# Altium schematic sheet 3_POWER SWITCH AND LDO.SchDoc
size 420 x 297 mm; SheetNumber: 3; SheetTotal: 7
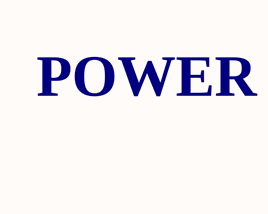
[diagram p0: 3_POWER SWITCH AND LDO.SchDoc, top left]
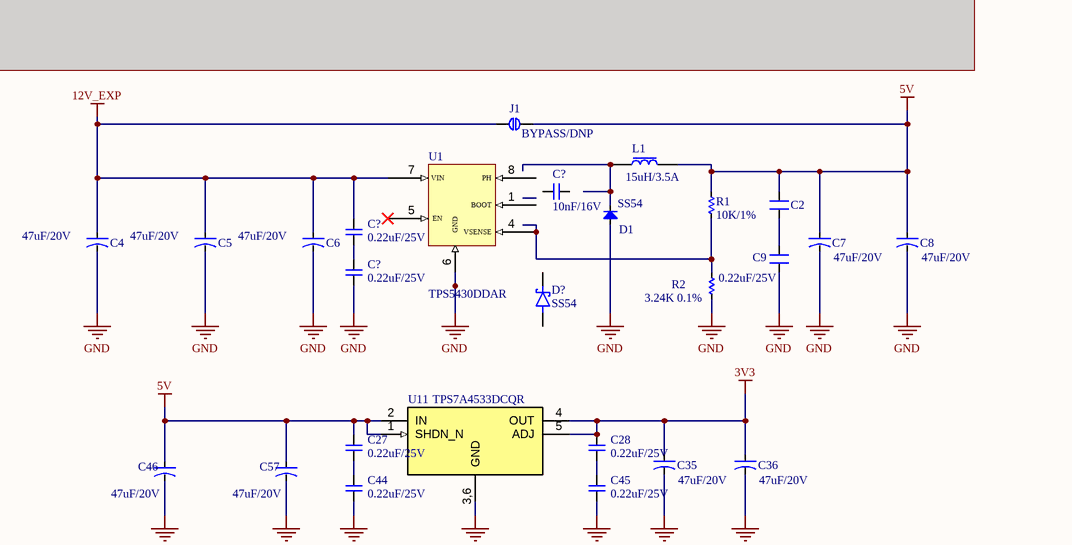
[diagram p1: 3_POWER SWITCH AND LDO.SchDoc, top right]
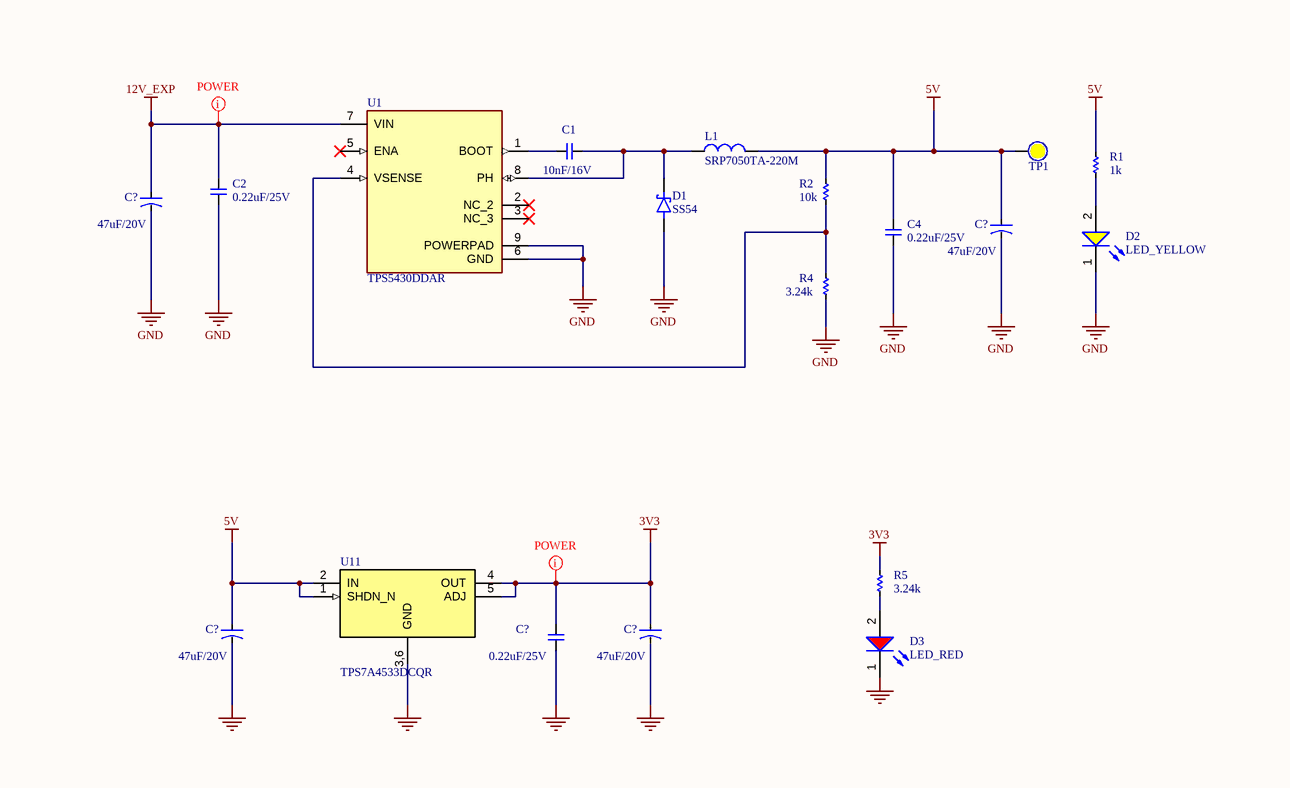
[diagram p2: 3_POWER SWITCH AND LDO.SchDoc, bottom right]

## Parts
(Parts that share a designator on the sheet are numbered #1, #2 ... from top to bottom, then left to right.)
C1  10nF/16V  [CAP_C_1005X50_L]
C2#1  0.22uF/25V  [SM-0603]  (value not drawn)
C2#2  0.22uF/25V  [CAP_C_1608X80]
C4#1  47uF/20V  [CAP TANT 2312]
C4#2  0.22uF/25V  [CAP_C_1608X80]
C5  47uF/20V  [CAP TANT 2312]
C6  47uF/20V  [CAP TANT 2312]
C7  47uF/20V  [CAP TANT 2312]
C8  47uF/20V  [CAP TANT 2312]
C9  0.22uF/25V  [SM-0603]
C27  0.22uF/25V  [CAP_C_1608X80]
C28  0.22uF/25V  [CAP_C_1608X80]
C35  47uF/20V  [CAP TANT 2312]
C36  47uF/20V  [CAP TANT 2312]
C44  0.22uF/25V  [CAP_C_1608X80]
C45  0.22uF/25V  [CAP_C_1608X80]
C46  47uF/20V  [CAP TANT 2312]
C57  47uF/20V  [CAP TANT 2312]
C?#1  10nF/16V  [CAP_C_1608X80]
C?#2  0.22uF/25V  [CAP_C_1608X80]
C?#3  0.22uF/25V  [CAP_C_1608X80]
C?#4  47uF/20V  [CAP TANT 2312]
C?#5  47uF/20V  [CAP TANT 2312]
C?#6  47uF/20V  [CAP TANT 2312]
C?#7  47uF/20V  [CAP TANT 2312]
C?#8  0.22uF/25V  [CAP_C_1608X80]
D1#1  SS54  [DIO-SMD-A]
D1#2  SS54  [DO-214AC_SMA]
D2  LED_YELLOW  [LED_0603]
D3  LED_RED  [LED_0603]
D?  SS54  [DO-214AC_SMA]
J1  BYPASS/DNP  [BIG_CONNECTOR]
L1#1  15uH/3.5A  [SRP7050TA]
L1#2  SRP7050TA-220M  [PSM6050]
R1#1  10K/1%  [RES-SMD-0603]
R1#2  1k  [RES_C_1005X40]
R2#1  3.24K 0.1%  [RES-SMD-0603]
R2#2  10k  [RES_C_1005x30_L]
R4  3.24k  [RES_C_1005x30_L]
R5  3.24k  [RES_C_1005X40]
TP1  (no value)  [Testpoint_50]  (no BOM)
U1#1  TPS5430DDAR  [HSOP8]
U1#2  TPS5430DDAR  [CONV_TPS5430DDAR]
U11#1  TPS7A4533DCQR  [SOT223-6]
U11#2  TPS7A4533DCQR  [SOT223-6]

## Nets
3V3: C28.2 C35.1 C36.1 C?#7.1 C?#8.2 R5.2 U11#1.4(OUT) U11#1.5(ADJ) U11#2.4(OUT) U11#2.5(ADJ)
5V: C2#1.2 C4#2.2 C7.1 C8.1 C27.2 C46.1 C57.1 C?#5.1 C?#6.1 J1.2 L1#1.2 L1#2.2 R1#1.2 R1#2.2 R2#2.2 TP1.1 U11#1.1(SHDN_N) U11#1.2(IN) U11#2.1(SHDN_N) U11#2.2(IN)
12V_EXP: C2#2.2 C4#1.1 C5.1 C6.1 C?#2.2 C?#4.1 J1.1 U1#1.7(VIN) U1#2.7(VIN)
GND: C2#2.1 C4#1.2 C4#2.1 C5.2 C6.2 C7.2 C8.2 C9.1 C35.2 C36.2 C44.1 C45.1 C46.2 C57.2 C?#3.1 C?#4.2 C?#5.2 C?#6.2 C?#7.2 C?#8.1 D1#1.1(A) D1#2.2(A) D2.1(K) D3.1(K) R2#1.1 R4.1 U1#1.6(GND) U1#2.6(GND) U1#2.9(POWERPAD) U11#1.3,6(GND) U11#2.3,6(GND)
NetC1_1: C1.1 D1#2.1(K) L1#2.1 U1#2.8(PH)
NetC1_2: C1.2 U1#2.1(BOOT)
NetC2#1_1: C2#1.1 C9.2
NetC27_1: C27.1 C44.2
NetC28_1: C28.1 C45.2
NetC?#2_1: C?#2.1 C?#3.2
NetD1#1_2: D1#1.2(K) L1#1.1
NetD2_2: D2.2(A) R1#2.1
NetD3_2: D3.2(A) R5.1
NetR1#1_1: R1#1.1 R2#1.2 U1#1.4(VSENSE)
NetR2#2_1: R2#2.1 R4.2 U1#2.4(VSENSE)

Not connected (* = marked no-connect by the designer): C?#1 1 2; D? 1(K) 2(A); U1#1 1(BOOT) 5(EN)* 8(PH); U1#2 2(NC_2)* 3(NC_3)* 5(ENA)*

## Layout directives
net class POWER: 3V3, 12V_EXP

## Notes on the sheet
- POWER SWITCH AND LDO
- Project:
- Sub-system:
- Design by:
- Sheet title:
- Sheet
- A3
- of
- Checked by:
- Approved by:
- Revision:
- Document No:
- Size:
- Date:

## Library data of the parts
C1 C2#2 C4#2 C27 C28 C44 C45 C?#1-C?#3 C?#8 = _CAP_C_2: CAP
C2#1 C9 = CM: CL10B224KA8NNNC; Value: 103
C4#1 C5-C8 C35 C36 C46 C57 C?#4-C?#7 = CN-ALU-SMD: TAJC476K020RNJ; Published: 8-Jun-2000; LatestRevisionDate: 17-Jul-2002; LatestRevisionNote: Re-released for DXP Platform.; PackageReference: POLAR0.8; Publisher: Altium Limited
D1#1 = Diode SMD: Code - JEDEC: DO-214-AB; Value: 1N5007; Published: 8-Jun-2000; Revision: July-2002: Re-released for DXP Platform.; Publisher: Altium Limited
D1#2 D? = DIODE SCHOTTKY
J1 = CNT: DNP
L1#1 = INDUCTOR: SRP7050TA-150M
L1#2 = SRP7050TA-220M: FIXED IND 22UH 2.5A 170 MOHM SMD
R1#1 = Res-SMD: ERJ-3EKF1002V; Manufacturer: Generic Components; Class: Passive; Published: 08/06/2000; Publisher: Altium Hobart Technology Centre
R1#2 R2#2 R4 R5 = _RES_B_2: RES
R2#1 = Res-SMD: ERJ-3EKF3241V; Manufacturer: Generic Components; Class: Passive; Published: 08/06/2000; Publisher: Altium Hobart Technology Centre
TP1 = Test Point: Solder: NF
U1#1 = TPS543X: pin to pad: 6>6+9
U1#2 = TPS5430DDAR: 5.5V to 36V Input, 3A, 500kHz Step-Down Converter; MF: Texas Instruments; Package: HSOIC-8 Texas Instruments; Check_prices: https://www.snapeda.com/parts/TPS5430DDAR/Texas+Instruments/view-part/?ref=eda; Value: *; Purchase-URL: https://pricing.snapeda.com/search/part/TPS5430DDAR/?ref=eda; Availability: In Stock; SnapEDA_Link: https://www.snapeda.com/parts/TPS5430DDAR/Texas+Instruments/view-part/?ref=snap; MP: TPS5430DDAR; Price: None